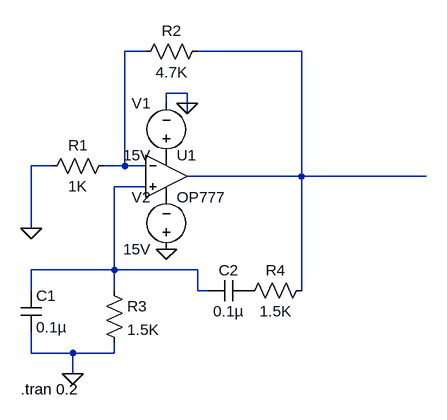
[diagram p0: schematic 2 wein bridge oscillator using opamp.asc]
2 wein bridge oscillator using opamp.asc, the LTspice schematic file:
Version 4
SHEET 1 880 680
WIRE 176 -16 144 -16
WIRE 416 -16 256 -16
WIRE 240 48 208 48
WIRE 208 64 208 48
WIRE 240 64 240 48
WIRE 240 80 240 64
WIRE 32 160 0 160
WIRE 144 160 144 -16
WIRE 144 160 112 160
WIRE 176 160 144 160
WIRE 416 176 416 -16
WIRE 416 176 240 176
WIRE 608 176 416 176
WIRE 176 192 128 192
WIRE 0 256 0 160
WIRE 128 320 128 192
WIRE 128 320 0 320
WIRE 256 320 128 320
WIRE 0 352 0 320
WIRE 128 352 128 320
WIRE 256 352 256 320
WIRE 272 352 256 352
WIRE 416 352 416 176
WIRE 0 448 0 416
WIRE 64 448 0 448
WIRE 128 448 128 432
WIRE 128 448 64 448
WIRE 64 480 64 448
FLAG 64 480 0
FLAG 208 288 0
FLAG 240 64 0
FLAG 0 256 0
SYMBOL OpAmps\\OP777 208 112 R0
SYMATTR InstName U1
SYMBOL res 128 144 R90
WINDOW 0 0 56 VBottom 2
WINDOW 3 32 56 VTop 2
SYMATTR InstName R1
SYMATTR Value 1K
SYMBOL cap -16 352 R0
SYMATTR InstName C1
SYMATTR Value 0.1µ
SYMBOL res 112 336 R0
SYMATTR InstName R3
SYMATTR Value 1.5K
SYMBOL voltage 208 160 R180
WINDOW 0 24 96 Left 2
WINDOW 3 24 16 Left 2
WINDOW 123 0 0 Left 0
WINDOW 39 0 0 Left 0
SYMATTR InstName V1
SYMATTR Value 15V
SYMBOL res 272 -32 R90
WINDOW 0 0 56 VBottom 2
WINDOW 3 32 56 VTop 2
SYMATTR InstName R2
SYMATTR Value 4.7K
SYMBOL voltage 208 304 R180
WINDOW 0 24 96 Left 2
WINDOW 3 24 16 Left 2
WINDOW 123 0 0 Left 0
WINDOW 39 0 0 Left 0
SYMATTR InstName V2
SYMATTR Value 15V
SYMBOL cap 336 336 R90
WINDOW 0 0 32 VBottom 2
WINDOW 3 32 32 VTop 2
SYMATTR InstName C2
SYMATTR Value 0.1µ
SYMBOL res 432 336 R90
WINDOW 0 0 56 VBottom 2
WINDOW 3 32 56 VTop 2
SYMATTR InstName R4
SYMATTR Value 1.5K
TEXT -16 504 Left 2 !.tran 0.2

The netlist it stands for:
* 2 wein bridge oscillator using opamp.asc
XU1 N003 N001 P001 P002 N002 OP777  ; pins In+ In- V+ V- OUT
R1 N001 0 1K
C1 N003 0 0.1µ
R3 N003 0 1.5K
V1 P001 0 15V
R2 N002 N001 4.7K
V2 0 P002 15V
C2 P003 N003 0.1µ
R4 N002 P003 1.5K
.tran 0.2
.lib ADI.lib
.backanno
.end